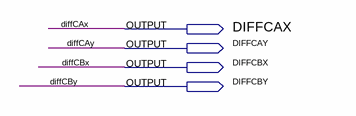
[diagram p0: schematic sheet]
// Quartus schematic backup.bdf as structural Verilog: 0 symbols, 4 pins
module backup (
  output DIFFCAX,
  output DIFFCAY,
  output DIFFCBX,
  output DIFFCBY
);
endmodule
